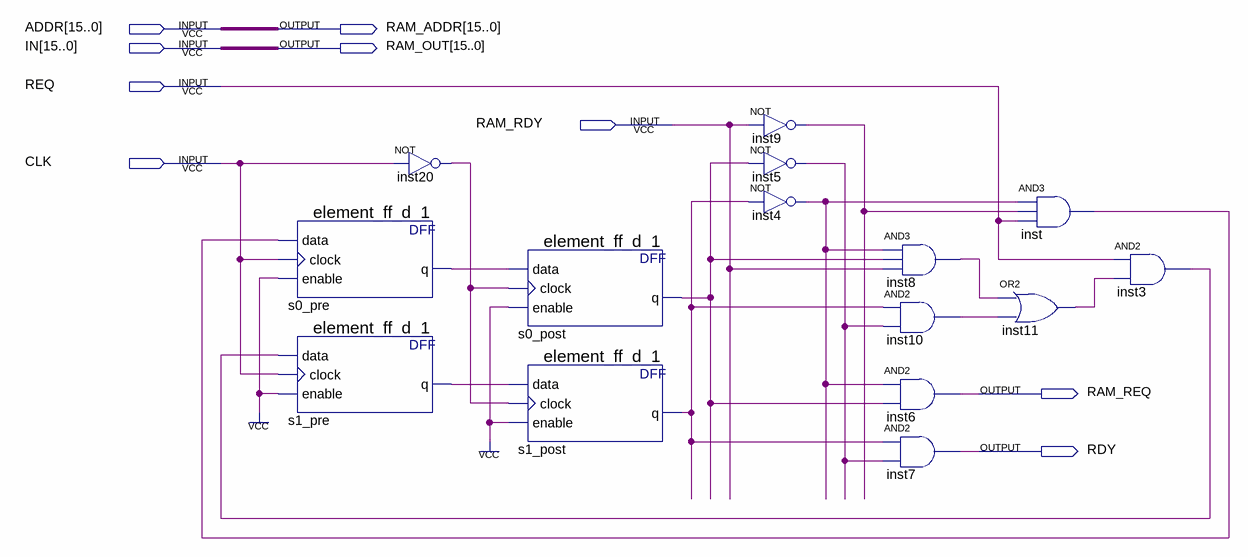
[diagram p0: schematic sheet]
// Quartus schematic block-writer-variant-write-to-ram.bdf as structural Verilog: 15 symbols, 9 pins
module \block-writer-variant-write-to-ram  (
  input  [15:0] ADDR,
  input  [15:0] IN,
  input  REQ,
  input  RAM_RDY,
  input  CLK,
  output [15:0] RAM_ADDR,
  output [15:0] RAM_OUT,
  output RAM_REQ,
  output RDY
);

  wire inst3_out, inst4_out, inst5_out, inst8_out, inst9_out, inst10_out, inst11_out, inst20_out, inst_out,
       s0_post_q, s0_pre_q, s1_post_q, s1_pre_q;

  element_ff_d_1 s0_pre (.data(inst_out), .clock(CLK), .enable(1'b1), .q(s0_pre_q));
  element_ff_d_1 s1_pre (.data(inst3_out), .clock(CLK), .enable(1'b1), .q(s1_pre_q));
  not inst20 (inst20_out, CLK);
  element_ff_d_1 s0_post (.data(s0_pre_q), .clock(inst20_out), .enable(1'b1), .q(s0_post_q));
  element_ff_d_1 s1_post (.data(s1_pre_q), .clock(inst20_out), .enable(1'b1), .q(s1_post_q));
  not inst9 (inst9_out, RAM_RDY);
  not inst5 (inst5_out, s0_post_q);
  not inst4 (inst4_out, s1_post_q);
  and inst8 (inst8_out, inst4_out, s0_post_q, RAM_RDY);
  and inst10 (inst10_out, s1_post_q, inst5_out);
  and inst6 (RAM_REQ, inst4_out, s0_post_q);
  and inst7 (RDY, s1_post_q, inst5_out);
  and inst (inst_out, inst4_out, inst9_out, REQ);
  or inst11 (inst11_out, inst8_out, inst10_out);
  and inst3 (inst3_out, REQ, inst11_out);

  assign RAM_ADDR = ADDR;
  assign RAM_OUT = IN;
endmodule
